# Altium project MC6205_Altium.PrjPcb (part 2 of 2)
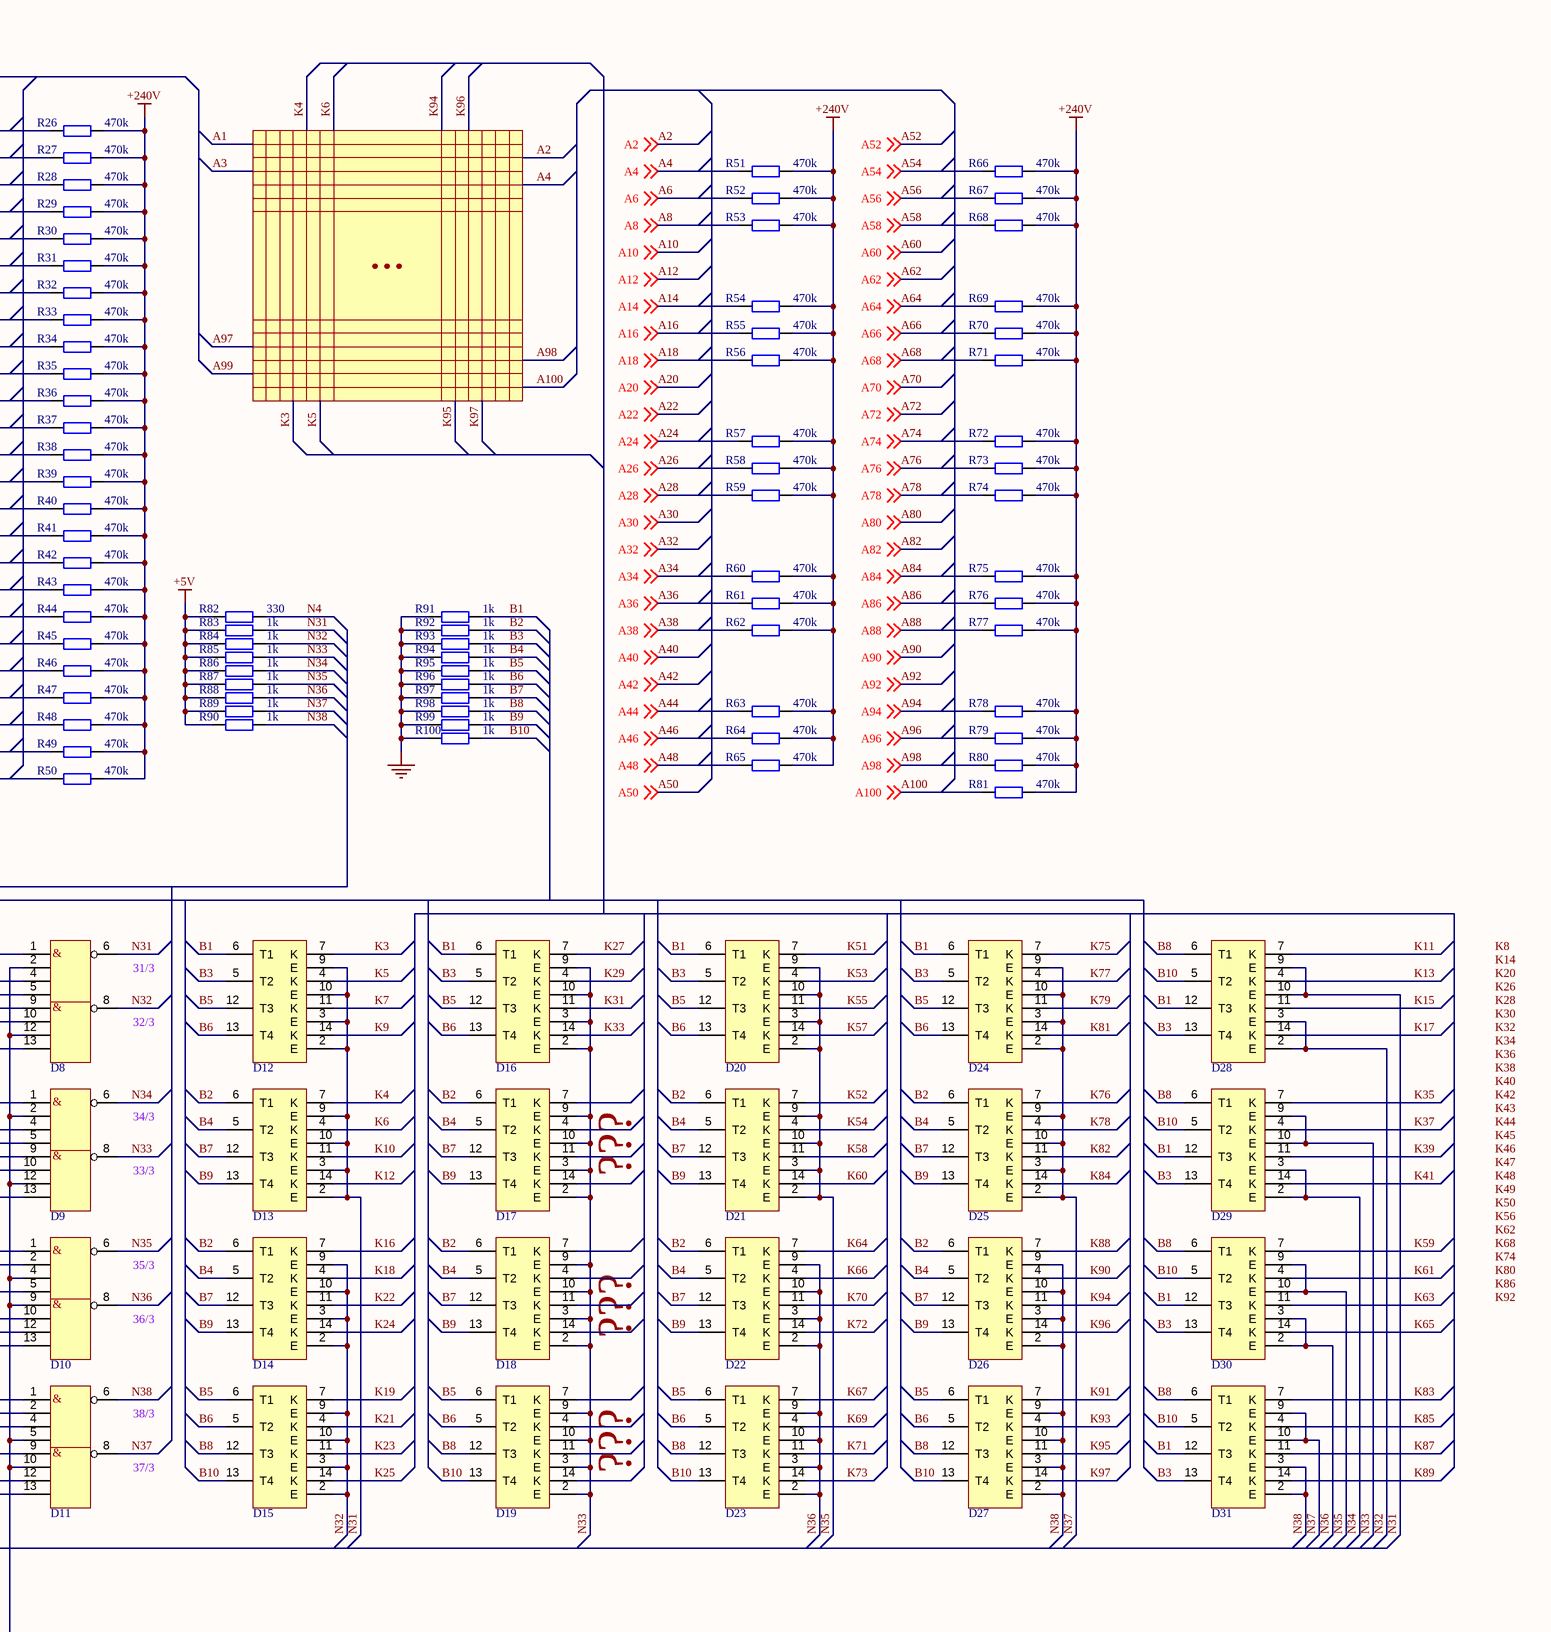
[diagram p7: Cathode_Switch.SchDoc, right]

## Nets that join several sheets
+5V: Permanent_Storage (14 pins), Operational_Storage (35 pins), Display_Driver (13 pins), Cathode_Switch (9 pins)
+240V: Permanent_Storage (5 pins), Display_Driver (P?#7.112 P?#8.12), Cathode_Switch (81 pins)
GND: Permanent_Storage (37 pins), Operational_Storage (40 pins), Display_Driver (96 pins), Cathode_Switch (10 pins)
A1: Operational_Storage (D1.2#2.3 D22#1.11), Display_Driver (P?#4.2 P?#8.8), Cathode_Switch (R1#4.2)
A2: Operational_Storage (D1.3#2.3 D21#1.11), Display_Driver (P?#8.10)
A3: Operational_Storage (D1.4#2.3 D23#1.11), Display_Driver (P?#4.5 P?#8.5 R1#3.1), Cathode_Switch (R2#4.2)
A4: Operational_Storage (D2.1#1.3 D18#1.11 D18#1.14), Display_Driver (P?#4.6 P?#8.9 R2#3.1), Cathode_Switch (R51#2.2)
A5: Operational_Storage (D2.2#1.3 D17#1.11), Display_Driver (P?#4.7 P?#8.7 R3#3.1), Cathode_Switch (R3#4.2)
A6: Operational_Storage (D10.1.3 D19#1.11), Display_Driver (P?#4.8 P?#8.11 R4#3.1), Cathode_Switch (R52#2.2)
A7: Operational_Storage (D2.4#1.3 D20#1.11), Display_Driver (P?#4.10 P?#8.6 R5#2.1), Cathode_Switch (R4#4.2)
A8: Operational_Storage (8 pins), Display_Driver (P?#4.11 R6#2.1), Cathode_Switch (R53#2.2)
A9: Operational_Storage (8 pins), Display_Driver (P?#4.12 R7#1.1), Cathode_Switch (R5#3.2)
A10: Operational_Storage (8 pins), Display_Driver (P?#4.13 R8#1.1)
A11: Operational_Storage (8 pins), Display_Driver (P?#4.15 R9#1.1), Cathode_Switch (R6#3.2)
A12: Operational_Storage (7 pins), Display_Driver (P?#4.16 R10#1.1)
A13: Operational_Storage (8 pins), Display_Driver (P?#4.17 R11#1.1), Cathode_Switch (R7#2.2)
A14: Operational_Storage (7 pins), Display_Driver (P?#4.18 R12#1.1), Cathode_Switch (R54#2.2)
A15: Operational_Storage (8 pins), Display_Driver (P?#4.20 R13#1.1), Cathode_Switch (R8#2.2)
A16: Operational_Storage (9 pins), Display_Driver (P?#4.21 R14#1.1), Cathode_Switch (R55#2.2)
A17: Display_Driver (P?#4.22 R15#1.1), Cathode_Switch (R9#2.2)
A18: Operational_Storage (9 pins), Display_Driver (P?#4.23 R16#1.1), Cathode_Switch (R56#2.2)
A19: Operational_Storage (9 pins), Display_Driver (P?#4.25 R17#1.1), Cathode_Switch (R10#2.2)
A21: Display_Driver (P?#4.27 R19#1.1), Cathode_Switch (R11#2.2)
A23: Display_Driver (P?#5.30 R21#1.1), Cathode_Switch (R12#2.2)
A24: Display_Driver (P?#5.31 R22#1.1), Cathode_Switch (R57#2.2)
A25: Display_Driver (P?#5.32 R23#1.1), Cathode_Switch (R13#2.2)
A26: Display_Driver (P?#5.33 R24#1.1), Cathode_Switch (R58#2.2)
A27: Display_Driver (P?#5.35 R25#1.1), Cathode_Switch (R14#2.2)
A28: Display_Driver (P?#5.36 R26#1.1), Cathode_Switch (R59#2.2)
A29: Display_Driver (P?#5.37 R27#1.1), Cathode_Switch (R15#2.2)
A31: Display_Driver (P?#5.40 R29#1.1), Cathode_Switch (R16#2.2)
A33: Display_Driver (P?#5.42 R31#1.1), Cathode_Switch (R17#2.2)
A34: Display_Driver (P?#5.43 R32#1.1), Cathode_Switch (R60#2.2)
A35: Display_Driver (P?#5.45 R33#1.1), Cathode_Switch (R18#2.2)
A36: Display_Driver (P?#5.46 R34#1.1), Cathode_Switch (R61#2.2)
A37: Display_Driver (P?#5.47 R35#1.1), Cathode_Switch (R19#2.2)
A38: Display_Driver (P?#5.48 R36#1.1), Cathode_Switch (R62#2.2)
A39: Display_Driver (P?#5.50 R37#1.1), Cathode_Switch (R20#2.2)
A41: Display_Driver (P?#5.52 R39#1.1), Cathode_Switch (R21#2.2)
A43: Display_Driver (P?#5.54), Cathode_Switch (R22#2.2)
A44: Display_Driver (P?#5.55), Cathode_Switch (R63#2.2)
A45: Display_Driver (P?#5.56), Cathode_Switch (R23#2.2)
A46: Display_Driver (P?#6.58), Cathode_Switch (R64#2.2)
A47: Display_Driver (P?#6.59), Cathode_Switch (R24#2.2)
A48: Display_Driver (P?#6.61 R68#1.1), Cathode_Switch (R65#2.2)
A49: Display_Driver (P?#6.62 R69#1.1), Cathode_Switch (R25#2.2)
A51: Display_Driver (P?#6.66 R64#1.1), Cathode_Switch (R26#2.2)
A53: Display_Driver (P?#6.68 R66#1.1), Cathode_Switch (R27#2.2)
A54: Display_Driver (P?#6.71 R67#1.1), Cathode_Switch (R66#2.2)
A55: Display_Driver (P?#6.72 R60#1.1), Cathode_Switch (R28#2.2)
A56: Display_Driver (P?#6.73 R61#1.1), Cathode_Switch (R67#2.2)
A57: Display_Driver (P?#6.76 R62#1.1), Cathode_Switch (R29#2.2)
A58: Display_Driver (P?#6.77 R63#1.1), Cathode_Switch (R68#2.2)
A59: Display_Driver (P?#6.78 R56#1.1), Cathode_Switch (R30#2.2)
A61: Display_Driver (P?#6.82 R58#1.1), Cathode_Switch (R31#2.2)
A63: Display_Driver (P?#7.86 R53#1.1), Cathode_Switch (R32#2.2)
A64: Display_Driver (P?#7.86 R54#1.1), Cathode_Switch (R69#2.2)
A65: Display_Driver (P?#7.87 R55#1.1), Cathode_Switch (R33#2.2)
A66: Display_Driver (P?#7.91 R49#1.1), Cathode_Switch (R70#2.2)
A67: Display_Driver (P?#7.92 R50#1.1), Cathode_Switch (R34#2.2)
A68: Display_Driver (P?#7.93 R51#1.1), Cathode_Switch (R71#2.2)
A69: Display_Driver (P?#7.96 R52#1.1), Cathode_Switch (R35#2.2)
A71: Display_Driver (P?#7.98 R46#1.1), Cathode_Switch (R36#2.2)
A73: Display_Driver (P?#7.102 R48#1.1), Cathode_Switch (R37#2.2)
A74: Display_Driver (P?#7.103 R41#1.1), Cathode_Switch (R72#2.2)
A75: Display_Driver (P?#7.106 R42#1.1), Cathode_Switch (R38#2.2)
A76: Display_Driver (P?#7.107 R43#1.1), Cathode_Switch (R73#2.2)
A77: Display_Driver (P?#7.108 R44#1.1), Cathode_Switch (R39#2.2)
A78: Display_Driver (P?#7.110), Cathode_Switch (R74#2.2)
A79: Display_Driver (P?#7.111), Cathode_Switch (R40#2.2)
B1: Operational_Storage (C6#2.1 D9.4.1 D9.4.2 XC1.B16), Display_Driver (R89#1.2 R110.2), Cathode_Switch (10 pins)
B2: Operational_Storage (D3#2.5 XC1.B6), Display_Driver (D1.5 D1.6 R130.2), Cathode_Switch (10 pins)
B3: Operational_Storage (D3#2.4 XC1.A6), Display_Driver (D1.12 R90#1.2), Cathode_Switch (10 pins)
B4: Operational_Storage (D3#2.14 XC1.A10), Display_Driver (D1.13 R140.2), Cathode_Switch (10 pins)
B5: Operational_Storage (D3#2.11 D4#2.11 XC1.A16), Display_Driver (D2#2.6 R109.2), Cathode_Switch (10 pins)
B6: Operational_Storage (D4#2.14 XC1.A12), Display_Driver (D2#2.5 R129.2), Cathode_Switch (10 pins)
B7: Operational_Storage (D9.1.2 XC1.B15), Display_Driver (D2#2.12), Cathode_Switch (10 pins)
B8: Operational_Storage (D1.1#2.1 D1.1#2.2 D10.2.2 XC1.A18), Display_Driver (D2#2.13 R139.2), Cathode_Switch (10 pins)
B9: Operational_Storage (D10.3.3 XC1.B19), Display_Driver (D3#3.6 R108.2), Cathode_Switch (10 pins)
B10: Operational_Storage (D3#2.15 XC1.B8), Display_Driver (D3#3.5 R128.2), Cathode_Switch (10 pins)
B11: Operational_Storage (D3#2.1 XC1.B7), Display_Driver (D3#3.12 R88#1.2)
B12: Operational_Storage (D3#2.10 XC1.B10), Display_Driver (D3#3.13 R138.2)
B13: Operational_Storage (D3#2.9 XC1.A14), Display_Driver (D4#3.6 R107.2)
B14: Operational_Storage (D4#2.15 XC1.B12), Display_Driver (D4#3.5 R127.2)
B15: Operational_Storage (D4#2.1 XC1.B11), Display_Driver (D4#3.12 R87#1.2)
B16: Operational_Storage (D4#2.10 XC1.B14), Display_Driver (D4#3.13 R137.2)
B17: Operational_Storage (D4#2.9 XC1.A20), Display_Driver (D5#2.6 R106.2)
B18: Operational_Storage (D8#2.6 XC1.A8), Display_Driver (D5#2.5 R126.2)
N1: Operational_Storage (D1.2#2.1 XC1.A22), Cathode_Switch (5 pins)
N2: Operational_Storage (D1.3#2.1 XC1.B22), Cathode_Switch (6 pins)
N3: Operational_Storage (D1.4#2.1 XC1.B20), Cathode_Switch (D1.2#3.3 D3#4.2 D4#4.6)
N4: Operational_Storage (D2.1#1.1 XC1.A24), Cathode_Switch (9 pins)
N5: Operational_Storage (D2.2#1.1 XC1.B23), Cathode_Switch (D2.2#2.3 D8#4.1 D10#4.5 D11#4.9)
N6: Operational_Storage (D10.1.1 R?#1.2 XC1.B18), Cathode_Switch (D2.1#2.3 D8#4.4 D10#4.1 D10#4.12)
N7: Operational_Storage (D2.3.1 R?#2.2 XC1.B24), Cathode_Switch (5 pins)
N8: Display_Driver (P?#8.14), Cathode_Switch (7 pins)
N9: Display_Driver (P?#8.18), Cathode_Switch (8 pins)
N10: Display_Driver (P?#8.17), Cathode_Switch (8 pins)
N11: Display_Driver (P?#8.16), Cathode_Switch (9 pins)
N12: Display_Driver (P?#8.1), Cathode_Switch (5 pins)
N13: Display_Driver (P?#8.2), Cathode_Switch (6 pins)
N14: Display_Driver (P?#8.3), Cathode_Switch (6 pins)
X8: Display_Driver (P?#8.4), Cathode_Switch (8 pins)